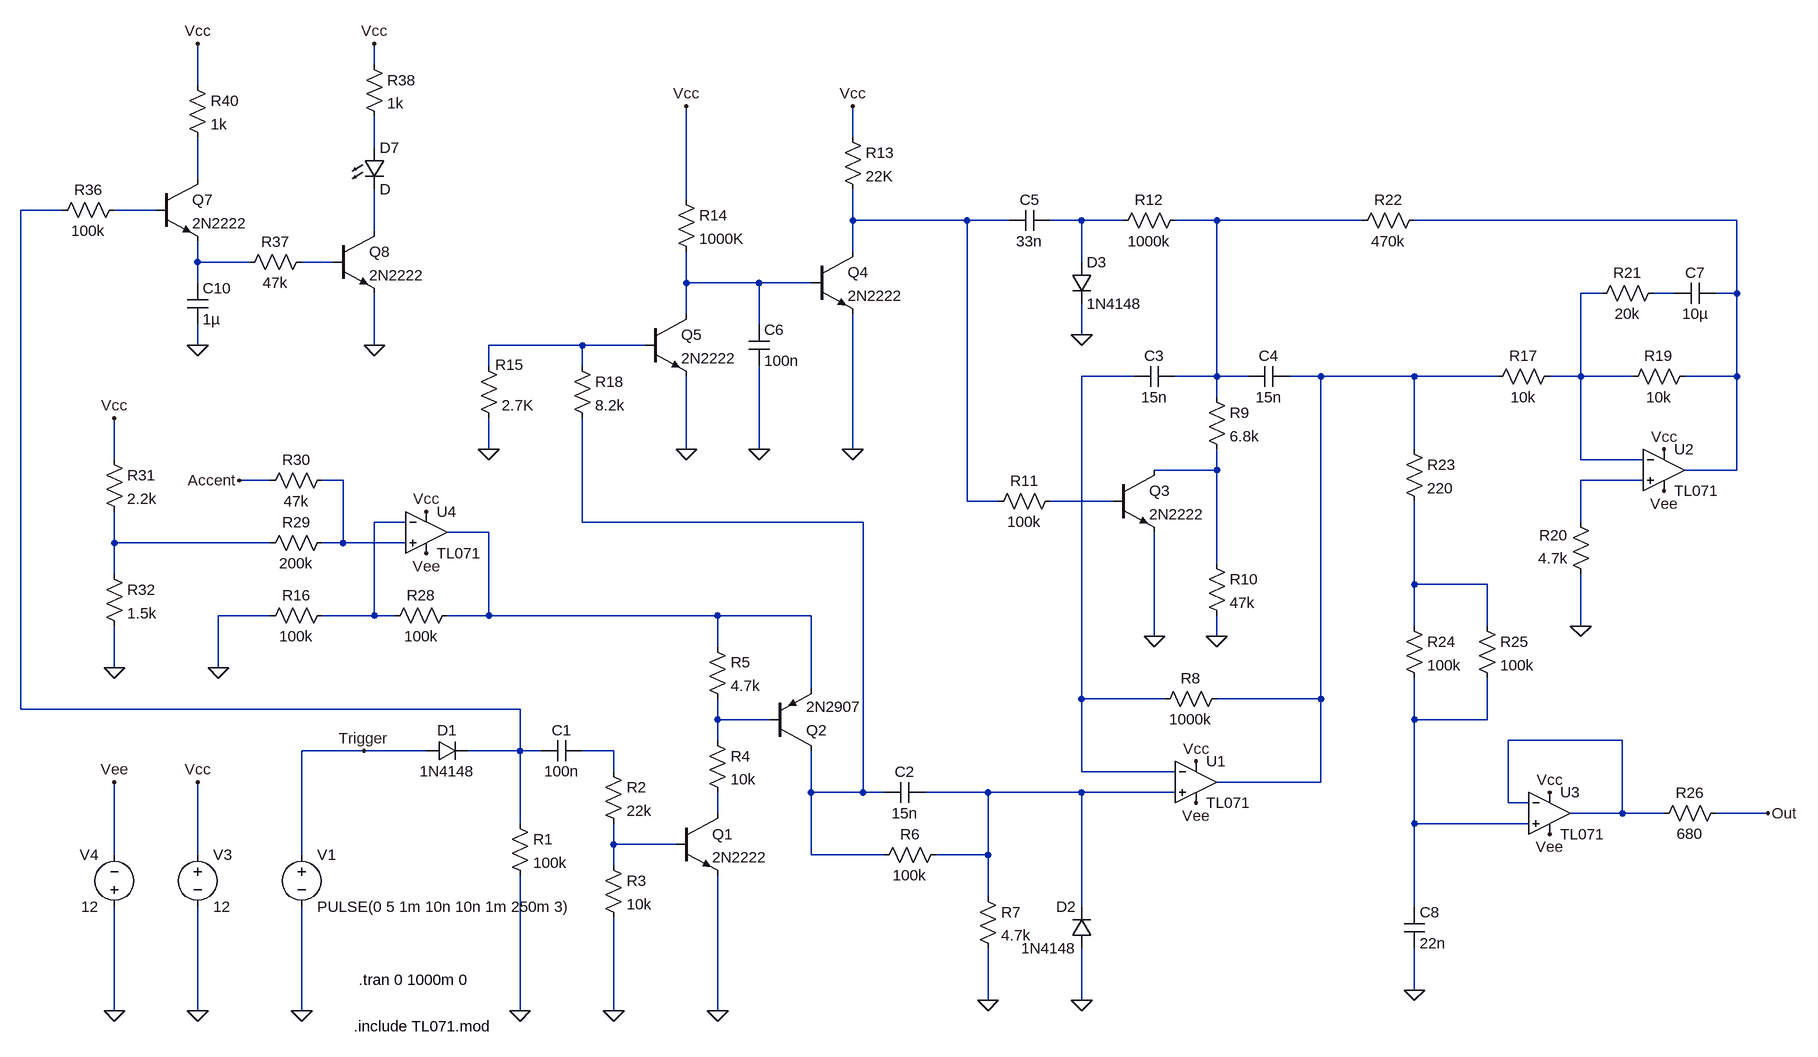
[diagram p0: schematic Kick.asc]
Kick.asc, the LTspice schematic file:
Version 4
SHEET 1 2108 680
WIRE -96 -1104 -96 -1136
WIRE -368 -1072 -368 -1136
WIRE 640 -992 640 -1040
WIRE -96 -976 -96 -1024
WIRE -368 -928 -368 -992
WIRE 384 -896 384 -1040
WIRE -576 -880 -640 -880
WIRE -432 -880 -496 -880
WIRE 640 -864 640 -912
WIRE 816 -864 640 -864
WIRE 880 -864 816 -864
WIRE 992 -864 944 -864
WIRE 1056 -864 992 -864
WIRE 1200 -864 1136 -864
WIRE 1424 -864 1200 -864
WIRE 2000 -864 1504 -864
WIRE -96 -848 -96 -912
WIRE 640 -816 640 -864
WIRE -368 -800 -368 -832
WIRE -288 -800 -368 -800
WIRE -160 -800 -208 -800
WIRE 992 -800 992 -864
WIRE -368 -768 -368 -800
WIRE 384 -768 384 -816
WIRE 496 -768 384 -768
WIRE 576 -768 496 -768
WIRE 1792 -752 1760 -752
WIRE 1904 -752 1872 -752
WIRE 2000 -752 2000 -864
WIRE 2000 -752 1968 -752
WIRE 384 -720 384 -768
WIRE 496 -704 496 -768
WIRE 992 -688 992 -736
WIRE -368 -672 -368 -704
WIRE -96 -672 -96 -752
WIRE 224 -672 80 -672
WIRE 320 -672 224 -672
WIRE 80 -640 80 -672
WIRE 224 -640 224 -672
WIRE 1072 -624 992 -624
WIRE 1200 -624 1200 -864
WIRE 1200 -624 1136 -624
WIRE 1248 -624 1200 -624
WIRE 1360 -624 1312 -624
WIRE 1504 -624 1360 -624
WIRE 1632 -624 1504 -624
WIRE 1760 -624 1760 -752
WIRE 1760 -624 1712 -624
WIRE 1840 -624 1760 -624
WIRE 2000 -624 2000 -752
WIRE 2000 -624 1920 -624
WIRE 1200 -592 1200 -624
WIRE 80 -512 80 -560
WIRE 384 -512 384 -624
WIRE 496 -512 496 -640
WIRE 640 -512 640 -720
WIRE 1504 -512 1504 -624
WIRE -496 -496 -496 -560
WIRE 1760 -496 1760 -624
WIRE 1856 -496 1760 -496
WIRE 1200 -480 1200 -512
WIRE 1200 -480 1104 -480
WIRE 2000 -480 2000 -624
WIRE 2000 -480 1920 -480
WIRE -256 -464 -304 -464
WIRE -144 -464 -176 -464
WIRE 1856 -464 1760 -464
WIRE 816 -432 816 -864
WIRE 864 -432 816 -432
WIRE 1040 -432 944 -432
WIRE -48 -400 -96 -400
WIRE 224 -400 224 -560
WIRE 656 -400 224 -400
WIRE 1760 -400 1760 -464
WIRE 80 -384 16 -384
WIRE -496 -368 -496 -416
WIRE -256 -368 -496 -368
WIRE -144 -368 -144 -464
WIRE -144 -368 -176 -368
WIRE -48 -368 -144 -368
WIRE 1200 -336 1200 -480
WIRE -496 -320 -496 -368
WIRE 1504 -304 1504 -432
WIRE 1616 -304 1504 -304
WIRE -256 -256 -336 -256
WIRE -96 -256 -96 -400
WIRE -96 -256 -176 -256
WIRE -64 -256 -96 -256
WIRE 80 -256 80 -384
WIRE 80 -256 16 -256
WIRE 432 -256 80 -256
WIRE 576 -256 432 -256
WIRE 1504 -240 1504 -304
WIRE 1616 -240 1616 -304
WIRE 1760 -240 1760 -320
WIRE 1104 -224 1104 -384
WIRE 1200 -224 1200 -256
WIRE 432 -208 432 -256
WIRE -496 -176 -496 -240
WIRE -336 -176 -336 -256
WIRE 576 -144 576 -256
WIRE 992 -128 992 -624
WIRE 1120 -128 992 -128
WIRE 1360 -128 1360 -624
WIRE 1360 -128 1200 -128
WIRE -640 -112 -640 -880
WIRE 128 -112 -640 -112
WIRE 432 -96 432 -128
WIRE 512 -96 432 -96
WIRE 1504 -96 1504 -160
WIRE 1616 -96 1616 -160
WIRE 1616 -96 1504 -96
WIRE 432 -64 432 -96
WIRE 1824 -64 1648 -64
WIRE -112 -48 -208 -48
WIRE -16 -48 -112 -48
WIRE 128 -48 128 -112
WIRE 128 -48 48 -48
WIRE 160 -48 128 -48
WIRE 272 -48 224 -48
WIRE 272 -16 272 -48
WIRE 992 -16 992 -128
WIRE 1136 -16 992 -16
WIRE 1360 0 1360 -128
WIRE 1360 0 1200 0
WIRE 576 16 576 -48
WIRE 656 16 656 -400
WIRE 656 16 576 16
WIRE 688 16 656 16
WIRE 848 16 752 16
WIRE 992 16 848 16
WIRE 1136 16 992 16
WIRE 1648 32 1648 -64
WIRE 1680 32 1648 32
WIRE 432 48 432 16
WIRE 1824 48 1824 -64
WIRE 1824 48 1744 48
WIRE 1888 48 1824 48
WIRE 2048 48 1968 48
WIRE 128 64 128 -48
WIRE 1504 64 1504 -96
WIRE 1680 64 1504 64
WIRE 272 96 272 64
WIRE 368 96 272 96
WIRE -496 112 -496 0
WIRE -368 112 -368 0
WIRE -208 112 -208 -48
WIRE 576 112 576 16
WIRE 688 112 576 112
WIRE 848 112 848 16
WIRE 848 112 768 112
WIRE 272 128 272 96
WIRE 848 176 848 112
WIRE 992 192 992 16
WIRE 1504 192 1504 64
WIRE 1504 320 1504 256
WIRE 848 336 848 256
WIRE 992 336 992 256
WIRE -496 352 -496 192
WIRE -368 352 -368 192
WIRE -208 352 -208 192
WIRE 128 352 128 144
WIRE 272 352 272 208
WIRE 432 352 432 144
FLAG 272 352 0
FLAG 848 336 0
FLAG 992 336 0
FLAG 432 352 0
FLAG -112 -48 Trigger
FLAG -304 -464 Accent
FLAG 128 352 0
FLAG -208 352 0
FLAG -368 352 0
FLAG -496 352 0
FLAG -496 0 Vee
FLAG 1168 -32 Vcc
FLAG 1168 32 Vee
FLAG 1104 -224 0
FLAG 1200 -224 0
FLAG 992 -688 0
FLAG 640 -1040 Vcc
FLAG 384 -1040 Vcc
FLAG 80 -512 0
FLAG 384 -512 0
FLAG 496 -512 0
FLAG 640 -512 0
FLAG 1888 -512 Vcc
FLAG 1888 -448 Vee
FLAG 1760 -240 0
FLAG 1712 16 Vcc
FLAG 1712 80 Vee
FLAG 1504 320 0
FLAG 2048 48 Out
FLAG -16 -416 Vcc
FLAG -16 -352 Vee
FLAG -336 -176 0
FLAG -496 -176 0
FLAG -368 0 Vcc
FLAG -496 -560 Vcc
FLAG -368 -672 0
FLAG -368 -1136 Vcc
FLAG -96 -1136 Vcc
FLAG -96 -672 0
DATAFLAG 992 16 ""
SYMBOL diode -16 -32 R270
WINDOW 0 32 32 VTop 2
WINDOW 3 0 32 VBottom 2
SYMATTR InstName D1
SYMATTR Value 1N4148
SYMBOL res 112 48 R0
SYMATTR InstName R1
SYMATTR Value 100k
SYMBOL cap 224 -64 R90
WINDOW 0 0 32 VBottom 2
WINDOW 3 32 32 VTop 2
SYMATTR InstName C1
SYMATTR Value 100n
SYMBOL res 256 -32 R0
SYMATTR InstName R2
SYMATTR Value 22k
SYMBOL npn 368 48 R0
SYMATTR InstName Q1
SYMATTR Value 2N2222
SYMBOL res 416 -80 R0
SYMATTR InstName R4
SYMATTR Value 10k
SYMBOL res 416 -224 R0
SYMATTR InstName R5
SYMATTR Value 4.7k
SYMBOL cap 752 0 R90
WINDOW 0 0 32 VBottom 2
WINDOW 3 32 32 VTop 2
SYMATTR InstName C2
SYMATTR Value 15n
SYMBOL res 784 96 R90
WINDOW 0 0 56 VBottom 2
WINDOW 3 32 56 VTop 2
SYMATTR InstName R6
SYMATTR Value 100k
SYMBOL res 832 160 R0
SYMATTR InstName R7
SYMATTR Value 4.7k
SYMBOL diode 1008 256 R180
WINDOW 0 24 64 Left 2
WINDOW 3 24 0 Left 2
SYMATTR InstName D2
SYMATTR Value 1N4148
SYMBOL voltage -208 96 R0
WINDOW 123 0 0 Left 0
WINDOW 39 0 0 Left 0
SYMATTR InstName V1
SYMATTR Value PULSE(0 5 1m 10n 10n 1m 250m 3)
SYMBOL res 256 112 R0
SYMATTR InstName R3
SYMATTR Value 10k
SYMBOL pnp 512 -48 M180
SYMATTR InstName Q2
SYMATTR Value 2N2907
SYMBOL Opamps\\opamp2 1168 -64 R0
SYMATTR InstName U1
SYMATTR Value TL071
SYMBOL voltage -368 96 R0
WINDOW 123 0 0 Left 0
WINDOW 39 0 0 Left 0
SYMATTR InstName V3
SYMATTR Value 12
SYMBOL voltage -496 208 R180
WINDOW 0 24 96 Left 2
WINDOW 3 24 16 Left 2
WINDOW 123 0 0 Left 0
WINDOW 39 0 0 Left 0
SYMATTR InstName V4
SYMATTR Value 12
SYMBOL res 1216 -144 R90
WINDOW 0 0 56 VBottom 2
WINDOW 3 32 56 VTop 2
SYMATTR InstName R8
SYMATTR Value 1000k
SYMBOL cap 1136 -640 R90
WINDOW 0 0 32 VBottom 2
WINDOW 3 32 32 VTop 2
SYMATTR InstName C3
SYMATTR Value 15n
SYMBOL cap 1312 -640 R90
WINDOW 0 0 32 VBottom 2
WINDOW 3 32 32 VTop 2
SYMATTR InstName C4
SYMATTR Value 15n
SYMBOL res 1184 -608 R0
SYMATTR InstName R9
SYMATTR Value 6.8k
SYMBOL res 1184 -352 R0
SYMATTR InstName R10
SYMATTR Value 47k
SYMBOL npn 1040 -480 R0
SYMATTR InstName Q3
SYMATTR Value 2N2222
SYMBOL res 960 -448 R90
WINDOW 0 0 56 VBottom 2
WINDOW 3 32 56 VTop 2
SYMATTR InstName R11
SYMATTR Value 100k
SYMBOL res 1152 -880 R90
WINDOW 0 0 56 VBottom 2
WINDOW 3 32 56 VTop 2
SYMATTR InstName R12
SYMATTR Value 1000k
SYMBOL cap 944 -880 R90
WINDOW 0 0 32 VBottom 2
WINDOW 3 32 32 VTop 2
SYMATTR InstName C5
SYMATTR Value 33n
SYMBOL diode 976 -800 R0
SYMATTR InstName D3
SYMATTR Value 1N4148
SYMBOL npn 576 -816 R0
SYMATTR InstName Q4
SYMATTR Value 2N2222
SYMBOL npn 320 -720 R0
SYMATTR InstName Q5
SYMATTR Value 2N2222
SYMBOL res 624 -1008 R0
SYMATTR InstName R13
SYMATTR Value 22K
SYMBOL res 368 -912 R0
SYMATTR InstName R14
SYMATTR Value 1000K
SYMBOL cap 480 -704 R0
SYMATTR InstName C6
SYMATTR Value 100n
SYMBOL res 64 -656 R0
WINDOW 0 26 14 Left 2
SYMATTR InstName R15
SYMATTR Value 2.7K
SYMBOL Opamps\\opamp2 1888 -544 R0
SYMATTR InstName U2
SYMATTR Value TL071
SYMBOL res 1728 -640 R90
WINDOW 0 0 56 VBottom 2
WINDOW 3 32 56 VTop 2
SYMATTR InstName R17
SYMATTR Value 10k
SYMBOL res 1936 -640 R90
WINDOW 0 0 56 VBottom 2
WINDOW 3 32 56 VTop 2
SYMATTR InstName R19
SYMATTR Value 10k
SYMBOL res 1776 -304 R180
WINDOW 0 36 76 Left 2
WINDOW 3 36 40 Left 2
SYMATTR InstName R20
SYMATTR Value 4.7k
SYMBOL res 1888 -768 R90
WINDOW 0 0 56 VBottom 2
WINDOW 3 32 56 VTop 2
SYMATTR InstName R21
SYMATTR Value 20k
SYMBOL cap 1968 -768 R90
WINDOW 0 0 32 VBottom 2
WINDOW 3 32 32 VTop 2
SYMATTR InstName C7
SYMATTR Value 10µ
SYMBOL res 1520 -880 R90
WINDOW 0 0 56 VBottom 2
WINDOW 3 32 56 VTop 2
SYMATTR InstName R22
SYMATTR Value 470k
SYMBOL Opamps\\opamp2 1712 -16 R0
SYMATTR InstName U3
SYMATTR Value TL071
SYMBOL res 1488 -528 R0
SYMATTR InstName R23
SYMATTR Value 220
SYMBOL res 1488 -256 R0
SYMATTR InstName R24
SYMATTR Value 100k
SYMBOL res 1600 -256 R0
SYMATTR InstName R25
SYMATTR Value 100k
SYMBOL cap 1488 192 R0
SYMATTR InstName C8
SYMATTR Value 22n
SYMBOL res 1984 32 R90
WINDOW 0 0 56 VBottom 2
WINDOW 3 32 56 VTop 2
SYMATTR InstName R26
SYMATTR Value 680
SYMBOL Opamps\\opamp2 -16 -448 R0
SYMATTR InstName U4
SYMATTR Value TL071
SYMBOL res 32 -272 R90
WINDOW 0 0 56 VBottom 2
WINDOW 3 32 56 VTop 2
SYMATTR InstName R28
SYMATTR Value 100k
SYMBOL res -160 -384 R90
WINDOW 0 0 56 VBottom 2
WINDOW 3 32 56 VTop 2
SYMATTR InstName R29
SYMATTR Value 200k
SYMBOL res -160 -480 R90
WINDOW 0 0 56 VBottom 2
WINDOW 3 32 56 VTop 2
SYMATTR InstName R30
SYMATTR Value 47k
SYMBOL res -512 -512 R0
SYMATTR InstName R31
SYMATTR Value 2.2k
SYMBOL res -512 -336 R0
SYMATTR InstName R32
SYMATTR Value 1.5k
SYMBOL res 208 -656 R0
SYMATTR InstName R18
SYMATTR Value 8.2k
SYMBOL res -160 -272 R90
WINDOW 0 0 56 VBottom 2
WINDOW 3 32 56 VTop 2
SYMATTR InstName R16
SYMATTR Value 100k
SYMBOL npn -432 -928 R0
SYMATTR InstName Q7
SYMATTR Value 2N2222
SYMBOL res -480 -896 R90
WINDOW 0 0 56 VBottom 2
WINDOW 3 32 56 VTop 2
SYMATTR InstName R36
SYMATTR Value 100k
SYMBOL LED -112 -976 R0
SYMATTR InstName D7
SYMBOL res -112 -1120 R0
SYMATTR InstName R38
SYMATTR Value 1k
SYMBOL cap -384 -768 R0
SYMATTR InstName C10
SYMATTR Value 1µ
SYMBOL res -384 -1088 R0
SYMATTR InstName R40
SYMATTR Value 1k
SYMBOL npn -160 -848 R0
SYMATTR InstName Q8
SYMATTR Value 2N2222
SYMBOL res -192 -816 R90
WINDOW 0 0 56 VBottom 2
WINDOW 3 32 56 VTop 2
SYMATTR InstName R37
SYMATTR Value 47k
TEXT -120 304 Left 2 !.tran 0 1000m 0
TEXT -128 376 Left 2 !.include TL071.mod

The netlist it stands for:
* Kick.asc
D1 Trigger N003 1N4148
R1 N003 0 100k
C1 N030 N003 100n
R2 N030 N033 22k
Q1 N032 N033 0 0 2N2222
R4 N027 N032 10k
R5 N024 N027 4.7k
C2 N031 N023 15n
R6 N031 N023 100k
R7 N031 0 4.7k
D2 0 N031 1N4148
V1 Trigger 0 PULSE(0 5 1m 10n 10n 1m 250m 3)
R3 N033 0 10k
Q2 N023 N027 N024 0 2N2907
XU1 N031 N016 Vcc Vee N017 TL071  ; pins In+ In- V+ V- OUT
V3 Vcc 0 12
V4 0 Vee 12
R8 N017 N016 1000k
C3 N007 N016 15n
C4 N017 N007 15n
R9 N007 N018 6.8k
R10 N018 0 47k
Q3 N018 N021 0 0 2N2222
R11 N021 N005 100k
R12 N007 N006 1000k
C5 N006 N005 33n
D3 N006 0 1N4148
Q4 N005 N012 0 0 2N2222
Q5 N012 N015 0 0 2N2222
R13 Vcc N005 22K
R14 Vcc N012 1000K
C6 N012 0 100n
R15 N015 0 2.7K
XU2 N020 N013 Vcc Vee N008 TL071  ; pins In+ In- V+ V- OUT
R17 N013 N017 10k
R19 N008 N013 10k
R20 0 N020 4.7k
R21 N014 N013 20k
C7 N008 N014 10µ
R22 N008 N007 470k
XU3 N028 N029 Vcc Vee N029 TL071  ; pins In+ In- V+ V- OUT
R23 N017 N026 220
R24 N026 N028 100k
R25 N026 N028 100k
C8 N028 0 22n
R26 Out N029 680
XU4 N019 N022 Vcc Vee N024 TL071  ; pins In+ In- V+ V- OUT
R28 N024 N022 100k
R29 N019 N025 200k
R30 N019 Accent 47k
R31 Vcc N025 2.2k
R32 N025 0 1.5k
R18 N015 N023 8.2k
R16 N022 0 100k
Q7 N002 N004 N010 0 2N2222
R36 N004 N003 100k
D7 N001 N009 D
R38 Vcc N001 1k
C10 N010 0 1µ
R40 Vcc N002 1k
Q8 N009 N011 0 0 2N2222
R37 N011 N010 47k
.model D D
.lib standard.dio
.model NPN NPN
.model PNP PNP
.lib standard.bjt
.tran 0 1000m 0
.include TL071.mod
.backanno
.end